# Altium schematic sheet 2012_BALISE_CARTE_RECEPTEUR.SchDoc
size A3
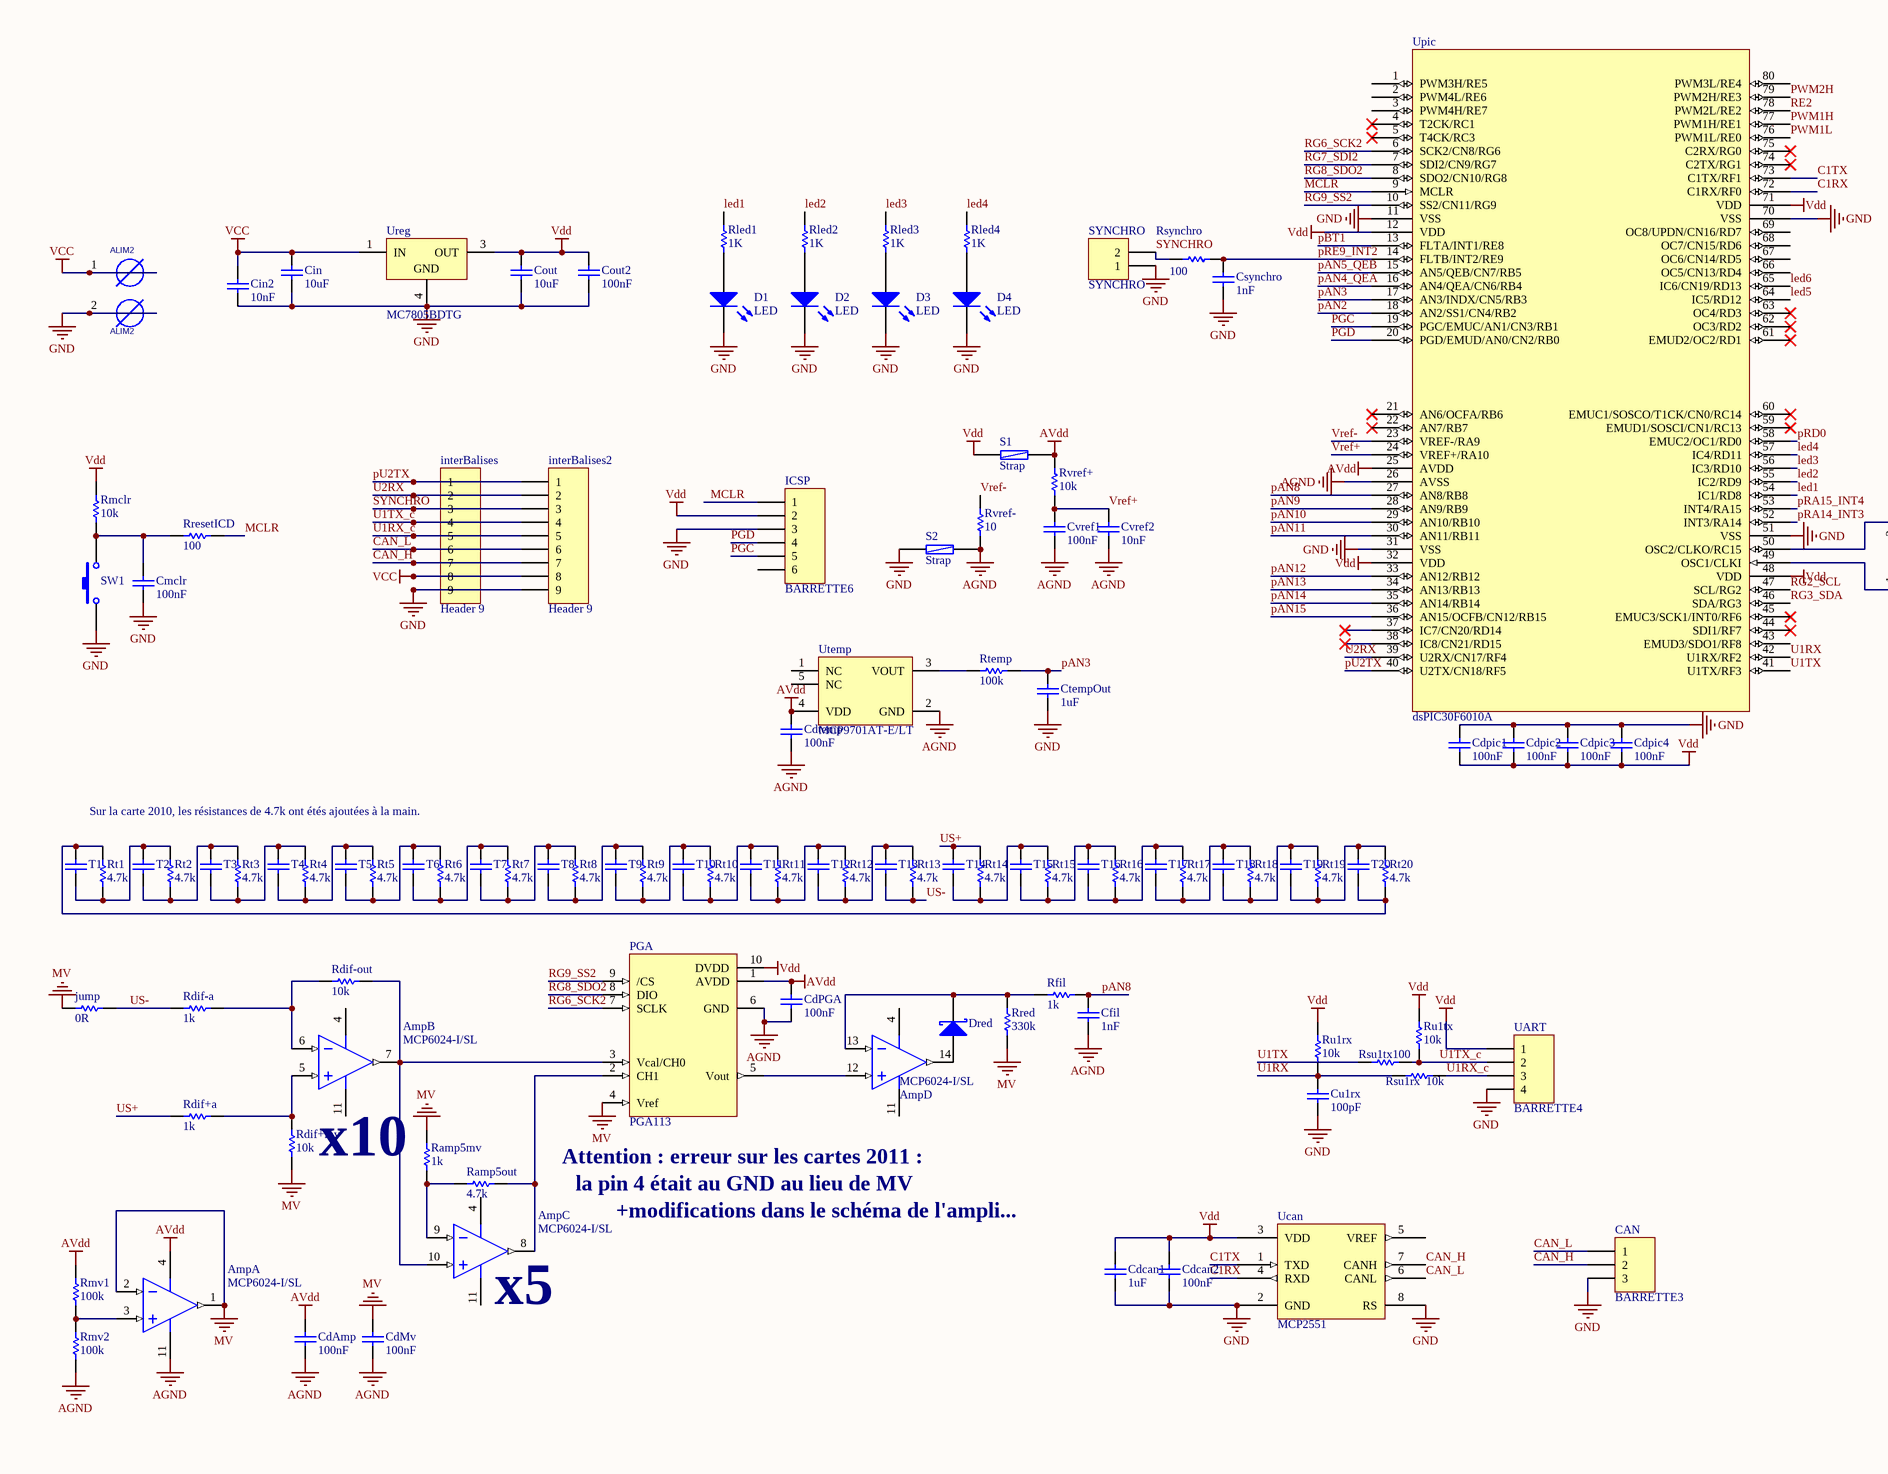
[diagram p0: 2012_BALISE_CARTE_RECEPTEUR.SchDoc, left]
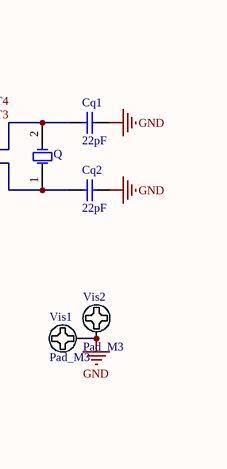
[diagram p1: 2012_BALISE_CARTE_RECEPTEUR.SchDoc, middle]
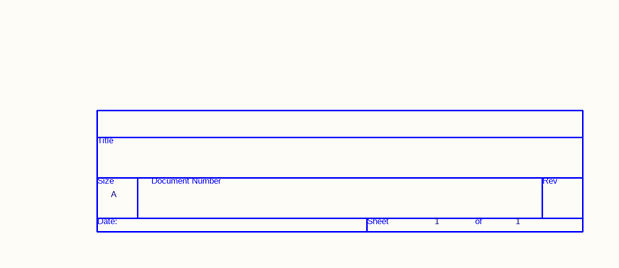
[diagram p2: 2012_BALISE_CARTE_RECEPTEUR.SchDoc, right]

## Parts
*  Page Count: 1  Page Size: A  (hidden comment: TitleBlock0)  (graphical)
ALIM2  ALIM2  [BORNIER2]
Amp  MCP6024-I/SL  [SO14_N]  (parts A,B,C,D of 4)
CAN  BARRETTE3  [HE14_3]
CdAmp  100nF  [C0805_N]
Cdcan1  1uF  [C1206_N]
Cdcan2  100nF  [C0805_N]
CdMv  100nF  [C0805_N]
CdPGA  100nF  [C0805_N]
Cdpic1  100nF  [C0805_N]
Cdpic2  100nF  [C0805_N]
Cdpic3  100nF  [C0805_N]
Cdpic4  100nF  [C0805_N]
Cdtemp  100nF  [C0805_N]
Cfil  1nF  [C0805_N]
Cin  10uF  [C1206_N]
Cin2  10nF  [C0805_N]
Cmclr  100nF  [C0805_N]
Cout  10uF  [C1206_N]
Cout2  100nF  [C0805_N]
Cq1  22pF  [C0805_N]
Cq2  22pF  [C0805_N]
Csynchro  1nF  [C0805_N]
CtempOut  1uF  [C0805_N]
Cu1rx  100pF  [C0805_N]
Cvref1  100nF  [C0805_N]
Cvref2  10nF  [C0805_N]
D1  LED  [LED_0805]
D2  LED  [LED_0805]
D3  LED  [LED_0805]
D4  LED  [LED_0805]
Dred  Diode Shottky BAT54  [SOT23-3N]  (value not drawn)
ICSP  BARRETTE6  [HE14_6]
interBalises  Header 9  [HDR1X9]
interBalises2  Header 9  [HDR1X9]
jump  0R  [R0603_N]
PGA  PGA113  [MSOP-UN10_N]
Q  QU  [HC49US]  (value not drawn)
Ramp5mv  1k  [R1206_N]
Ramp5out  4.7k  [R1206_N]
Rdif+a  1k  [R1206_N]
Rdif+mv  10k  [R1206_N]
Rdif-a  1k  [R1206_N]
Rdif-out  10k  [R1206_N]
Rfil  1k  [R1206_N]
Rled1  1K  [R1206_N]
Rled2  1K  [R1206_N]
Rled3  1K  [R1206_N]
Rled4  1K  [R1206_N]
Rmclr  10k  [R1206_N]
Rmv1  100k  [R1206_N]
Rmv2  100k  [R1206_N]
Rred  330k  [R1206_N]
RresetICD  100  [R1206_N]
Rsu1rx  10k  [R1206_N]
Rsu1tx  100  [R1206_N]
Rsynchro  100  [R1206_N]
Rt1  4.7k  [R1206_N]
Rt2  4.7k  [R1206_N]
Rt3  4.7k  [R1206_N]
Rt4  4.7k  [R1206_N]
Rt5  4.7k  [R1206_N]
Rt6  4.7k  [R1206_N]
Rt7  4.7k  [R1206_N]
Rt8  4.7k  [R1206_N]
Rt9  4.7k  [R1206_N]
Rt10  4.7k  [R1206_N]
Rt11  4.7k  [R1206_N]
Rt12  4.7k  [R1206_N]
Rt13  4.7k  [R1206_N]
Rt14  4.7k  [R1206_N]
Rt15  4.7k  [R1206_N]
Rt16  4.7k  [R1206_N]
Rt17  4.7k  [R1206_N]
Rt18  4.7k  [R1206_N]
Rt19  4.7k  [R1206_N]
Rt20  4.7k  [R1206_N]
Rtemp  100k  [R1206_N]
Ru1rx  10k  [R1206_N]
Ru1tx  10k  [R1206_N]
Rvref+  10k  [R1206_N]
Rvref-  10  [R1206_N]
S1  Strap  [R0805_N]
S2  Strap  [R0805_N]
SW1  SW_Pushbutton_6x6mm_Vertical  [Switch 6x6 Vertical]  (value not drawn)
SYNCHRO  SYNCHRO  [HEADER2]
T1  40kHz  [MA40S4R/S Transducteur US - 3D_mi_carte]  (value not drawn)
T2  40kHz  [MA40S4R/S Transducteur US - 3D_mi_carte]  (value not drawn)
T3  40kHz  [MA40S4R/S Transducteur US - 3D_mi_carte]  (value not drawn)
T4  40kHz  [MA40S4R/S Transducteur US - 3D_mi_carte]  (value not drawn)
T5  40kHz  [MA40S4R/S Transducteur US - 3D_mi_carte]  (value not drawn)
T6  40kHz  [MA40S4R/S Transducteur US - 3D_mi_carte]  (value not drawn)
T7  40kHz  [MA40S4R/S Transducteur US - 3D_mi_carte]  (value not drawn)
T8  40kHz  [MA40S4R/S Transducteur US - 3D_mi_carte]  (value not drawn)
T9  40kHz  [MA40S4R/S Transducteur US - 3D_mi_carte]  (value not drawn)
T10  40kHz  [MA40S4R/S Transducteur US - 3D_mi_carte]  (value not drawn)
T11  40kHz  [MA40S4R/S Transducteur US - 3D_mi_carte]  (value not drawn)
T12  40kHz  [MA40S4R/S Transducteur US - 3D_mi_carte]  (value not drawn)
T13  40kHz  [MA40S4R/S Transducteur US - 3D_mi_carte]  (value not drawn)
T14  40kHz  [MA40S4R/S Transducteur US - 3D_mi_carte]  (value not drawn)
T15  40kHz  [MA40S4R/S Transducteur US - 3D_mi_carte]  (value not drawn)
T16  40kHz  [MA40S4R/S Transducteur US - 3D_mi_carte]  (value not drawn)
T17  40kHz  [MA40S4R/S Transducteur US - 3D_mi_carte]  (value not drawn)
T18  40kHz  [MA40S4R/S Transducteur US - 3D_mi_carte]  (value not drawn)
T19  40kHz  [MA40S4R/S Transducteur US - 3D_mi_carte]  (value not drawn)
T20  40kHz  [MA40S4R/S Transducteur US - 3D_mi_carte]  (value not drawn)
UART  BARRETTE4  [HE14_4]
Ucan  MCP2551  [SO8_N]
Upic  dsPIC30F6010A  [TQFP80_N]
Ureg  MC7805BDTG  [369A-13]
Utemp  MCP9701AT-E/LT  [SC70-LT5_N]
Vis1  Pad_M3  [M3x6mm]
Vis2  Pad_M3  [M3x6mm]

## Nets
AGND: Amp.11(VSS) CdAmp.1 CdMv.1 CdPGA.1 Cdtemp.1 Cfil.1 Cvref1.1 Cvref2.1 PGA.6(GND) Rmv2.1 Rvref-.1 S2.2 Upic.26(AVSS) Utemp.2(GND)
AVdd: Amp.4(VDD) CdAmp.2 CdPGA.2 Cdtemp.2 PGA.1(AVDD) Rmv1.2 Rvref+.2 S1.2 Upic.25(AVDD) Utemp.4(VDD)
GND: ALIM2.2(B2) CAN.3 Cdcan1.1 Cdcan2.1 Cdpic1.2 Cdpic2.2 Cdpic3.2 Cdpic4.2 Cin.1 Cin2.1 Cmclr.1 Cout.1 Cout2.1 Cq1.2 Cq2.2 Csynchro.2 CtempOut.1 Cu1rx.1 D1.2 D2.2 D3.2 D4.2 ICSP.3 interBalises.9 interBalises2.9 S2.1 SW1.1 SYNCHRO.1 UART.4 Ucan.2(GND) Ucan.8(RS) Upic.11(VSS) Upic.31(VSS) Upic.51(VSS) Upic.70(VSS) Ureg.4(GND) Vis1.1 Vis2.1
MV: Amp.1(VOUTA) Amp.2(VINA-) CdMv.2 jump.1 PGA.4(Vref) Ramp5mv.2 Rdif+mv.1 Rred.2
VCC: ALIM2.1(B1) Cin.2 Cin2.2 interBalises.8 interBalises2.8 Ureg.1(IN)
Vdd: Cdcan1.2 Cdcan2.2 Cdpic1.1 Cdpic2.1 Cdpic3.1 Cdpic4.1 Cout.2 Cout2.2 ICSP.2 PGA.10(DVDD) Rmclr.2 Ru1rx.2 Ru1tx.2 S1.1 UART.1 Ucan.3(VDD) Upic.12(VDD) Upic.32(VDD) Upic.48(VDD) Upic.71(VDD) Ureg.3(OUT)
C1RX: Ucan.4(RXD) Upic.72(C1RX/RF0)
C1TX: Ucan.1(TXD) Upic.73(C1TX/RF1)
CAN_H: CAN.2 interBalises.7 interBalises2.7 Ucan.7(CANH)
CAN_L: CAN.1 interBalises.6 interBalises2.6 Ucan.6(CANL)
led1: Rled1.2 Upic.54(IC1/RD8)
led2: Rled2.2 Upic.55(IC2/RD9)
led3: Rled3.2 Upic.56(IC3/RD10)
led4: Rled4.2 Upic.57(IC4/RD11)
led5: Upic.64(IC5/RD12)
led6: Upic.65(IC6/CN19/RD13)
MCLR: ICSP.1 RresetICD.1 Upic.9(MCLR)
pAN2: Upic.18(AN2/SS1/CN4/RB2)
pAN3: CtempOut.2 Rtemp.1 Upic.17(AN3/INDX/CN5/RB3)
pAN4_QEA: Upic.16(AN4/QEA/CN6/RB4)
pAN5_QEB: Upic.15(AN5/QEB/CN7/RB5)
pAN8: Cfil.2 Rfil.2 Upic.27(AN8/RB8)
pAN9: Upic.28(AN9/RB9)
pAN10: Upic.29(AN10/RB10)
pAN11: Upic.30(AN11/RB11)
pAN12: Upic.33(AN12/RB12)
pAN13: Upic.34(AN13/RB13)
pAN14: Upic.35(AN14/RB14)
pAN15: Upic.36(AN15/OCFB/CN12/RB15)
pBT1: Upic.13(FLTA/INT1/RE8)
PGC: ICSP.5 Upic.19(PGC/EMUC/AN1/CN3/RB1)
PGD: ICSP.4 Upic.20(PGD/EMUD/AN0/CN2/RB0)
pRA14_INT3: Upic.52(INT3/RA14)
pRA15_INT4: Upic.53(INT4/RA15)
pRD0: Upic.58(EMUC2/OC1/RD0)
pRE9_INT2: Csynchro.1 Rsynchro.2 Upic.14(FLTB/INT2/RE9)
pU2TX: interBalises.1 interBalises2.1 Upic.40(U2TX/CN18/RF5)
PWM1H: Upic.77(PWM1H/RE1)
PWM1L: Upic.76(PWM1L/RE0)
PWM2H: Upic.79(PWM2H/RE3)
RE2: Upic.78(PWM2L/RE2)
RG2_SCL: Upic.47(SCL/RG2)
RG3_SDA: Upic.46(SDA/RG3)
RG6_SCK2: PGA.7(SCLK) Upic.6(SCK2/CN8/RG6)
RG7_SDI2: Upic.7(SDI2/CN9/RG7)
RG8_SDO2: PGA.8(DIO) Upic.8(SDO2/CN10/RG8)
RG9_SS2: PGA.9(/CS) Upic.10(SS2/CN11/RG9)
SYNCHRO: interBalises.3 interBalises2.3 Rsynchro.1 SYNCHRO.2
U1RX: Cu1rx.2 Rsu1rx.2 Ru1rx.1 Upic.42(U1RX/RF2)
U1RX_c: interBalises.5 interBalises2.5 Rsu1rx.1 UART.3
U1TX: Rsu1tx.2 Upic.41(U1TX/RF3)
U1TX_c: interBalises.4 interBalises2.4 Rsu1tx.1 Ru1tx.1 UART.2
U2RX: interBalises.2 interBalises2.2 Upic.39(U2RX/CN17/RF4)
US+: Rdif+a.2 Rt14.1 T14.2
US-: jump.2 Rdif-a.2 Rt13.2 T13.1
Vref+: Cvref1.2 Cvref2.2 Rvref+.1 Upic.24(VREF+/RA10)
Vref-: Rvref-.2 Upic.23(VREF-/RA9)
NetAmp_3: Amp.3(VINA+) Rmv1.1 Rmv2.2
NetAmp_5: Amp.5(VINB+) Rdif+a.1 Rdif+mv.2
NetAmp_6: Amp.6(VINB-) Rdif-a.1 Rdif-out.2
NetAmp_7: Amp.7(VOUTB) Amp.10(VINC+) PGA.3(Vcal/CH0) Rdif-out.1
NetAmp_8: Amp.8(VOUTC) PGA.2(CH1) Ramp5out.1
NetAmp_9: Amp.9(VINC-) Ramp5mv.1 Ramp5out.2
NetAmp_12: Amp.12(VIND+) PGA.5(Vout)
NetAmp_13: Amp.13(VIND-) Dred.3(K) Rfil.1 Rred.1
NetAmp_14: Amp.14(VOUTD) Dred.1(A)
NetCmclr_2: Cmclr.2 Rmclr.1 RresetICD.2 SW1.3
NetCq1_1: Cq1.1 Q.2(OSC2) Upic.50(OSC2/CLKO/RC15)
NetCq2_1: Cq2.1 Q.1(OSC1) Upic.49(OSC1/CLKI)
NetD1_1: D1.1 Rled1.1
NetD2_1: D2.1 Rled2.1
NetD3_1: D3.1 Rled3.1
NetD4_1: D4.1 Rled4.1
NetRt1_1: Rt1.1 Rt20.2 T1.2 T20.1
NetRt1_2: Rt1.2 Rt2.1 T1.1 T2.2
NetRt2_2: Rt2.2 Rt3.1 T2.1 T3.2
NetRt3_2: Rt3.2 Rt4.1 T3.1 T4.2
NetRt4_2: Rt4.2 Rt5.1 T4.1 T5.2
NetRt5_2: Rt5.2 Rt6.1 T5.1 T6.2
NetRt6_2: Rt6.2 Rt7.1 T6.1 T7.2
NetRt7_2: Rt7.2 Rt8.1 T7.1 T8.2
NetRt8_2: Rt8.2 Rt9.1 T8.1 T9.2
NetRt9_2: Rt9.2 Rt10.1 T9.1 T10.2
NetRt10_2: Rt10.2 Rt11.1 T10.1 T11.2
NetRt11_2: Rt11.2 Rt12.1 T11.1 T12.2
NetRt12_2: Rt12.2 Rt13.1 T12.1 T13.2
NetRt14_2: Rt14.2 Rt15.1 T14.1 T15.2
NetRt15_2: Rt15.2 Rt16.1 T15.1 T16.2
NetRt16_2: Rt16.2 Rt17.1 T16.1 T17.2
NetRt17_2: Rt17.2 Rt18.1 T17.1 T18.2
NetRt18_2: Rt18.2 Rt19.1 T18.1 T19.2
NetRt19_2: Rt19.2 Rt20.1 T19.1 T20.2
NetRtemp_2: Rtemp.2 Utemp.3(VOUT)

Not connected (* = marked no-connect by the designer): ICSP 6; Ucan 5(VREF); Upic 1(PWM3H/RE5) 2(PWM4L/RE6) 3(PWM4H/RE7) 4(T2CK/RC1)* 5(T4CK/RC3)* 21(AN6/OCFA/RB6)* 22(AN7/RB7)* 37(IC7/CN20/RD14)* 38(IC8/CN21/RD15)* 43(EMUD3/SDO1/RF8) 44(SDI1/RF7)* 45(EMUC3/SCK1/INT0/RF6)* 59(EMUD1/SOSCI/CN1/RC13)* 60(EMUC1/SOSCO/T1CK/CN0/RC14)* 61(EMUD2/OC2/RD1)* 62(OC3/RD2)* 63(OC4/RD3)* 66(OC5/CN13/RD4) 67(OC6/CN14/RD5) 68(OC7/CN15/RD6) 69(OC8/UPDN/CN16/RD7) 74(C2TX/RG1)* 75(C2RX/RG0)* 80(PWM3L/RE4); Utemp 1(NC) 5(NC)

## Notes on the sheet
- Sur la carte 2010, les résistances de 4.7k ont étés ajoutées à la main.
- x10
- Attention : erreur sur les cartes 2011 :
- la pin 4 était au GND au lieu de MV
- (near Cdcan1) +modifications dans le schéma de l'ampli...
- (near Amp) x5
- Title
- Size:
- Date:
- A3
- Number:
- Time:
- Revision:
- Sheet
- of
- File:
- (in symbol TitleBlock0) Title; Size; Document Number; Rev; Date:; Sheet; of

## Library data of the parts
ALIM2 = BORNIER2
Amp = MCP6024-I/SL: Rail-to-Rail Input/Output, 10 MHz Operational Amplifier, 14-Pin SOIC, Industrial Temperature; Published: 29-Jan-2009; DatasheetVersion: revC, Mar-2006; PackageVersion: revAW, Oct-2008; PackageReference: SOIC-SL14; Publisher: Altium Limited; PackageDescription: 14-Lead Plastic Small Outline (SL) - Narrow, 3.90mm Body [SOIC]; Code_JEDEC: MS-012-AB; Code_IPC: SOIC127P600-14; ComponentLink1Description: Manufacturer Link; ComponentLink1URL: http://www.microchip.com; ComponentLink2Description: Datasheet; ComponentLink2URL: http://ww1.microchip.com/downloads/en/DeviceDoc/21685c.pdf; ComponentLink3Description: Packaging Specification; ComponentLink3URL: http://ww1.microchip.com/downloads/en/PackagingSpec/00049AW.pdf
CAN = BARRETTE3: Header, 3-Pin; LatestRevisionDate: 17-Jul-2002; LatestRevisionNote: Re-released for DXP Platform.; Publisher: Altium Limited
CdAmp Cdcan1 Cdcan2 CdMv CdPGA Cdpic1-Cdpic4 Cdtemp Cfil Cin Cin2 Cmclr Cout Cout2 Cq1 Cq2 Csynchro CtempOut Cu1rx Cvref1 Cvref2 = Capacitor: Published: 8-Jun-2000; LatestRevisionDate: 17-Jul-2002; LatestRevisionNote: Re-released for DXP Platform.; PackageReference: RAD-0.3; Publisher: Altium Limited
D1-D4 = LED: Typical LED; Published: 8-Jun-2000; LatestRevisionDate: 08-Jul-2005; LatestRevisionNote: Mech Layer 1 removed.; PackageReference: LED-1; Publisher: Altium Limited
Dred = Diode Shottky BAT54: DIODE, SCHOTTKY, SOT-23; Description: BAT54 - DIODE, SCHOTTKY, SOT-23; ComponentLink1URL: http://www.farnell.com/datasheets/62627.pdf; ComponentLink1Description: http://www.farnell.com/datasheets/62627.pdf; Supplier Part Number: 1621832; Supplier: Farnell; Pricing: 10=0,074, 250=0,054, 1000=0,044, 3000=0,038 (EUR); Manufacturer Part Number: BAT54; RoHS: YES
ICSP = BARRETTE6: Header, 6-Pin; LatestRevisionDate: 17-Jul-2002; LatestRevisionNote: Re-released for DXP Platform.; Publisher: Altium Limited
interBalises interBalises2 = Header 9: Header, 9-Pin; LatestRevisionDate: 17-Jul-2002; LatestRevisionNote: Re-released for DXP Platform.; Publisher: Altium Limited
jump Ramp5mv Ramp5out Rdif+a Rdif+mv Rdif-a Rdif-out Rfil Rled1-Rled4 Rmclr Rmv1 Rmv2 Rred RresetICD Rsu1rx Rsu1tx Rsynchro Rt1-Rt20 Rtemp Ru1rx Ru1tx Rvref+ Rvref- = Resistor: Published: 8-Jun-2000; LatestRevisionDate: 17-Jul-2002; LatestRevisionNote: Re-released for DXP Platform.; PackageReference: AXIAL-0.5; Publisher: Altium Limited
PGA = PGA113: Programmable Gain Amplifier
Q = QUARTZ_DROIT_BAS_PROFIL: Crystal Oscillator; FAR: 1666999; FAR: test; Published: 8-Jun-2000; LatestRevisionDate: 17-Jul-2002; LatestRevisionNote: Re-released for DXP Platform.; PackageReference: R38; Publisher: Altium Limited; Type: DROIT_BAS_PROFIL
S1 S2 = Fusible_SMD: Fuse; Published: 8-Jun-2000; LatestRevisionDate: 17-Jul-2002; LatestRevisionNote: Re-released for DXP Platform.; PackageReference: PIN-W2/E2.8; Publisher: Altium Limited
SW1 = SW_Pushbutton_6x6mm_Vertical: Switch tactil 6mm x 6mm Vertical; Published: 27/11/09; PackageReference: 6mm X 6mm; Publisher: Damien Guitton
SYNCHRO = BARRETTE2: Header, 2-Pin; LatestRevisionDate: 17-Jul-2002; LatestRevisionNote: Re-released for DXP Platform.; Publisher: Altium Limited
T1-T20 = Condensateur: Capacitor; Published: 8-Jun-2000; LatestRevisionDate: 17-Jul-2002; LatestRevisionNote: Re-released for DXP Platform.; PackageReference: RAD-0.3; Publisher: Altium Limited
UART = BARRETTE4: Header, 4-Pin; LatestRevisionDate: 17-Jul-2002; LatestRevisionNote: Re-released for DXP Platform.; Publisher: Altium Limited
Ucan = MCP2551: High Speed Can Transceiver; Published: 6-Oct-2005; LatestRevisionDate: 13-Apr-2006; LatestRevisionNote: IPC-7351 Footprint Added.; DatasheetVersion: Nov-2003; PackageVersion: Oct-2005; PackageReference: SOIC150-8; Publisher: Altium Limited; PackageDescription: 8-Pin Plastic Narrow Body Small Outline Integrated Circuit 1.27 mm Pitch; Code_JEDEC: MS-012; ComponentLink1Description: Manufacturer Link; ComponentLink1URL: http://www.microchip.com; ComponentLink2Description: Datasheet; ComponentLink2URL: http://ww1.microchip.com/downloads/en/DeviceDoc/21667d.pdf
Upic = dsPIC30F6010A: High-Performance, 16-bit Digital Signal Controllers
Ureg = MC7805ACD2T: Three-Terminal Positive Voltage Regulator; Note: Pin 2 is electrically connected to Pin 4; Pin 2 is trimmed and not drawn;; Published: 15-Apr-2002; DatasheetVersion: 1997; PackageVersion: 1997; PackageReference: 936-03; Publisher: Altium Limited; PackageDescription: D2-PAK/TO-263-AB; 3 Leads (1 Cropped); Body 14.7 (inc. leads) x 10.2 mm (LxW max); ComponentLink1Description: Manufacturer Link; ComponentLink1URL: http://www.onsemi.com/site/products/taxonomy/0,4438,503,00.html; ComponentLink2Description: Datasheet; ComponentLink2URL: http://www.onsemi.com/pub/Collateral/MC7800-D.PDF
Utemp = MCP9701AT-E/LT: Low-Power Linear Active Thermistor IC, 5-Pin SC-70, Extended Temperature, Tape and Reel; FirstPublished: 29-Jan-2009; LatestRevisionDate: 02-Dec-2009; LatestRevisionNote: Updated datasheet to version revE, Apr-2009.; DatasheetVersion: revE, Apr-2009; PackageVersion: revBB, Aug-2009; PackageReference: SC70-LT5; Publisher: Altium Limited; PackageDescription: 5-Lead Plastic Small Outline Transistor (LT) [SC70]; Supplier 1: Digi-Key; Supplier Part Number 1: MCP9701AT-E/LTTR-ND; Supplier 2: Digi-Key; Supplier Part Number 2: MCP9701AT-E/LTCT-ND; Supplier 3: Digi-Key; Supplier Part Number 3: MCP9701AT-E/LTDKR-ND; Supplier 4: Farnell; Supplier Part Number 4: 1627203; Supplier 5: Newark; Supplier Part Number 5: 88K5692; Code_IPC: SOT353-5; ComponentLink1Description: Datasheet; ComponentLink1URL: http://ww1.microchip.com/downloads/en/DeviceDoc/21942e.pdf; ComponentLink2Description: Packaging Specification; ComponentLink2URL: http://www.microchip.com/stellent/groups/techpub_sg/documents/packagingspec/en012702.pdf; ComponentLink3Description: Microchip.com Home; ComponentLink3URL: http://www.microchip.com/
Vis1 Vis2 = Vis M3 X 6mm _TORX_Tête 6mm: Publisher: Damien Guitton
* = TitleBlock0: Page Number: 1; Page Create Date: March  8, 1995